# Altium schematic sheet misc.SchDoc: Miscellaneous Design Items
size A3; Date: DO NOT USE, RATHER USE PROJ OPTIONS; DrawnBy: DO NOT USE, RATHER USE PROJ OPTIONS; Engineer: DO NOT USE, RATHER USE PROJ OPTIONS; Organization: DO NOT USE, RATHER USE PROJ OPTIONS; DocumentNumber: DO NOT USE, RATHER USE PROJ OPTIONS; Revision: DO NOT USE, RATHER USE PROJ OPTIONS; SheetNumber: 27; SheetTotal: 29; SCH_Sheet_Filename: misc.SchDoc; CurrentTime: DO NOT USE, RATHER USE PROJ OPTIONS; Time: DO NOT USE, RATHER USE PROJ OPTIONS; DocumentFullPathAndName: DO NOT USE, RATHER USE PROJ OPTIONS; DocumentName: DO NOT USE, RATHER USE PROJ OPTIONS; ModifiedDate: DO NOT USE, RATHER USE PROJ OPTIONS; ImagePath: DO NOT USE, RATHER USE PROJ OPTIONS
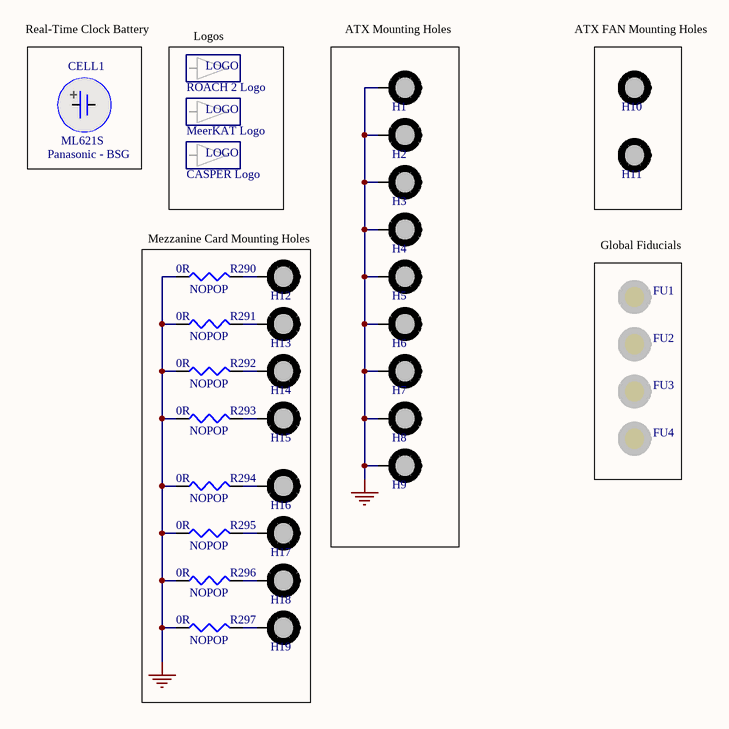
[diagram p0: misc.SchDoc]

## Parts
CELL1  Manufacturer: Panasonic - BSG  (hidden comment: ML621S)  (mechanical)
FU1  FIDUCIAL  [FIDUCIAL_1MM]  (value not drawn)  (no BOM)
FU2  FIDUCIAL  [FIDUCIAL_1MM]  (value not drawn)  (no BOM)
FU3  FIDUCIAL  [FIDUCIAL_1MM]  (value not drawn)  (no BOM)
FU4  FIDUCIAL  [FIDUCIAL_1MM]  (value not drawn)  (no BOM)
H1  MH_ATX  [MH_ATX]  (value not drawn)  (no BOM)
H2  MH_ATX  [MH_ATX]  (value not drawn)  (no BOM)
H3  MH_ATX  [MH_ATX]  (value not drawn)  (no BOM)
H4  MH_ATX  [MH_ATX]  (value not drawn)  (no BOM)
H5  MH_ATX  [MH_ATX]  (value not drawn)  (no BOM)
H6  MH_ATX  [MH_ATX]  (value not drawn)  (no BOM)
H7  MH_ATX  [MH_ATX]  (value not drawn)  (no BOM)
H8  MH_ATX  [MH_ATX]  (value not drawn)  (no BOM)
H9  MH_ATX  [MH_ATX]  (value not drawn)  (no BOM)
H10  MH_NC  [MH_FANATX]  (value not drawn)  (no BOM)
H11  MH_NC  [MH_FANATX]  (value not drawn)  (no BOM)
H12  MH_ATX  [MH_ATX]  (value not drawn)  (no BOM)
H13  MH_ATX  [MH_ATX]  (value not drawn)  (no BOM)
H14  MH_ATX  [MH_ATX]  (value not drawn)  (no BOM)
H15  MH_ATX  [MH_ATX]  (value not drawn)  (no BOM)
H16  MH_ATX  [MH_ATX]  (value not drawn)  (no BOM)
H17  MH_ATX  [MH_ATX]  (value not drawn)  (no BOM)
H18  MH_ATX  [MH_ATX]  (value not drawn)  (no BOM)
H19  MH_ATX  [MH_ATX]  (value not drawn)  (no BOM)
LOGO1  ROACH 2 Logo  [ROACH2_LOGO]  (no BOM)
LOGO2  MeerKAT Logo  [MEERKAT_LOGO]  (no BOM)
LOGO3  CASPER Logo  [CASPER_LOGO]  (no BOM)
R290  0R  [RESC1005X40L]
R291  0R  [RESC1005X40L]
R292  0R  [RESC1005X40L]
R293  0R  [RESC1005X40L]
R294  0R  [RESC1005X40L]
R295  0R  [RESC1005X40L]
R296  0R  [RESC1005X40L]
R297  0R  [RESC1005X40L]

## Nets
GND: H1.1 H2.1 H3.1 H4.1 H5.1 H6.1 H7.1 H8.1 H9.1 R290.1 R291.1 R292.1 R293.1 R294.1 R295.1 R296.1 R297.1
NetH12_1: H12.1 R290.2
NetH13_1: H13.1 R291.2
NetH14_1: H14.1 R292.2
NetH15_1: H15.1 R293.2
NetH16_1: H16.1 R294.2
NetH17_1: H17.1 R295.2
NetH18_1: H18.1 R296.2
NetH19_1: H19.1 R297.2

## Notes on the sheet
- Real-Time Clock Battery
- (near LOGO1) Logos
- (near H1) ATX Mounting Holes
- (near H10) ATX FAN Mounting Holes
- Mezzanine Card Mounting Holes
- (near FU1) Global Fiducials
- (near R290) NOPOP
- (near R291) NOPOP
- (near R292) NOPOP
- (near R293) NOPOP
- (near R294) NOPOP
- (near R295) NOPOP
- (near R296) NOPOP
- (near R297) NOPOP
- 2009   THIS DOCUMENT IS THE PROPERTY OF THE OWNER, AND MAY NOT BE COPIED OR USED FOR ANY PURPOSE OTHER THAN THAT FOR WHICH IT IS SUPPLIED WITHOUT PERMISSION IN WRITING FROM THE OWNER.
- C
- DATESTAMP OF THIS PRINT
- DRAWN BY:
- DOCUMENT NUMBER:
- SCHEMATIC FILENAME:
- PCB FILENAME:
- ENGINEER:
- APPROVED:
- CIRCUIT DIAGRAM
- DATE
- SHEET
- REVISION
- OF

## Library data of the parts
CELL1 = ELMECH-BAT-0: 3V,  6.8mm Mangenese Lithium Battery; POD number: ELMECH-BAT-0; PartNum: ML621S; RoHS: Y; Value: 3V; Category: ELMECH; Subcategory: Batteries
FU1-FU4 = MECH-FU-1: 1mm Fiducial mark; POD number: MECH-FU-1; RoHS: Y; Category: MECH; Subcategory: Fiducial
H1-H9 H12-H19 = ELMECH-MH-0: 3.81mm Diameter, ATX mounting hole; POD number: ELMECH-MH-0; RoHS: Y; Category: ELMECH; Subcategory: Mounting Holes
H10 H11 = ELMECH-MH-1: 3.2mm Diameter, Unplated, Floating mounting Hole; POD number: ELMECH-MH-1; RoHS: Y; Category: ELMECH; Subcategory: Mounting Holes
LOGO1 = GRAPH-LOGO-0: POD number: GRAPH-LOGO-0; RoHS: Y; Category: GRAPH; Subcategory: Logo
LOGO2 = GRAPH-LOGO-1: POD number: GRAPH-LOGO-1; RoHS: Y; Category: GRAPH; Subcategory: Logo
LOGO3 = GRAPH-LOGO-2: POD number: GRAPH-LOGO-2; RoHS: Y; Category: GRAPH; Subcategory: Logo
R290-R297 = RES-TF-0: 0R, 1.1mm x 0.5mm, Thick Film Resistor; Manufacturer: ROYALOHM; PartNum: 0402WG00000T1E; Tolerance: 0%; Rating: 0.0625W; POD number: RES-TF-0; Value: 0R; Sort Value: 0; Category: Resistors; Subcategory: ThickFilm; HelpURL: *.pdf